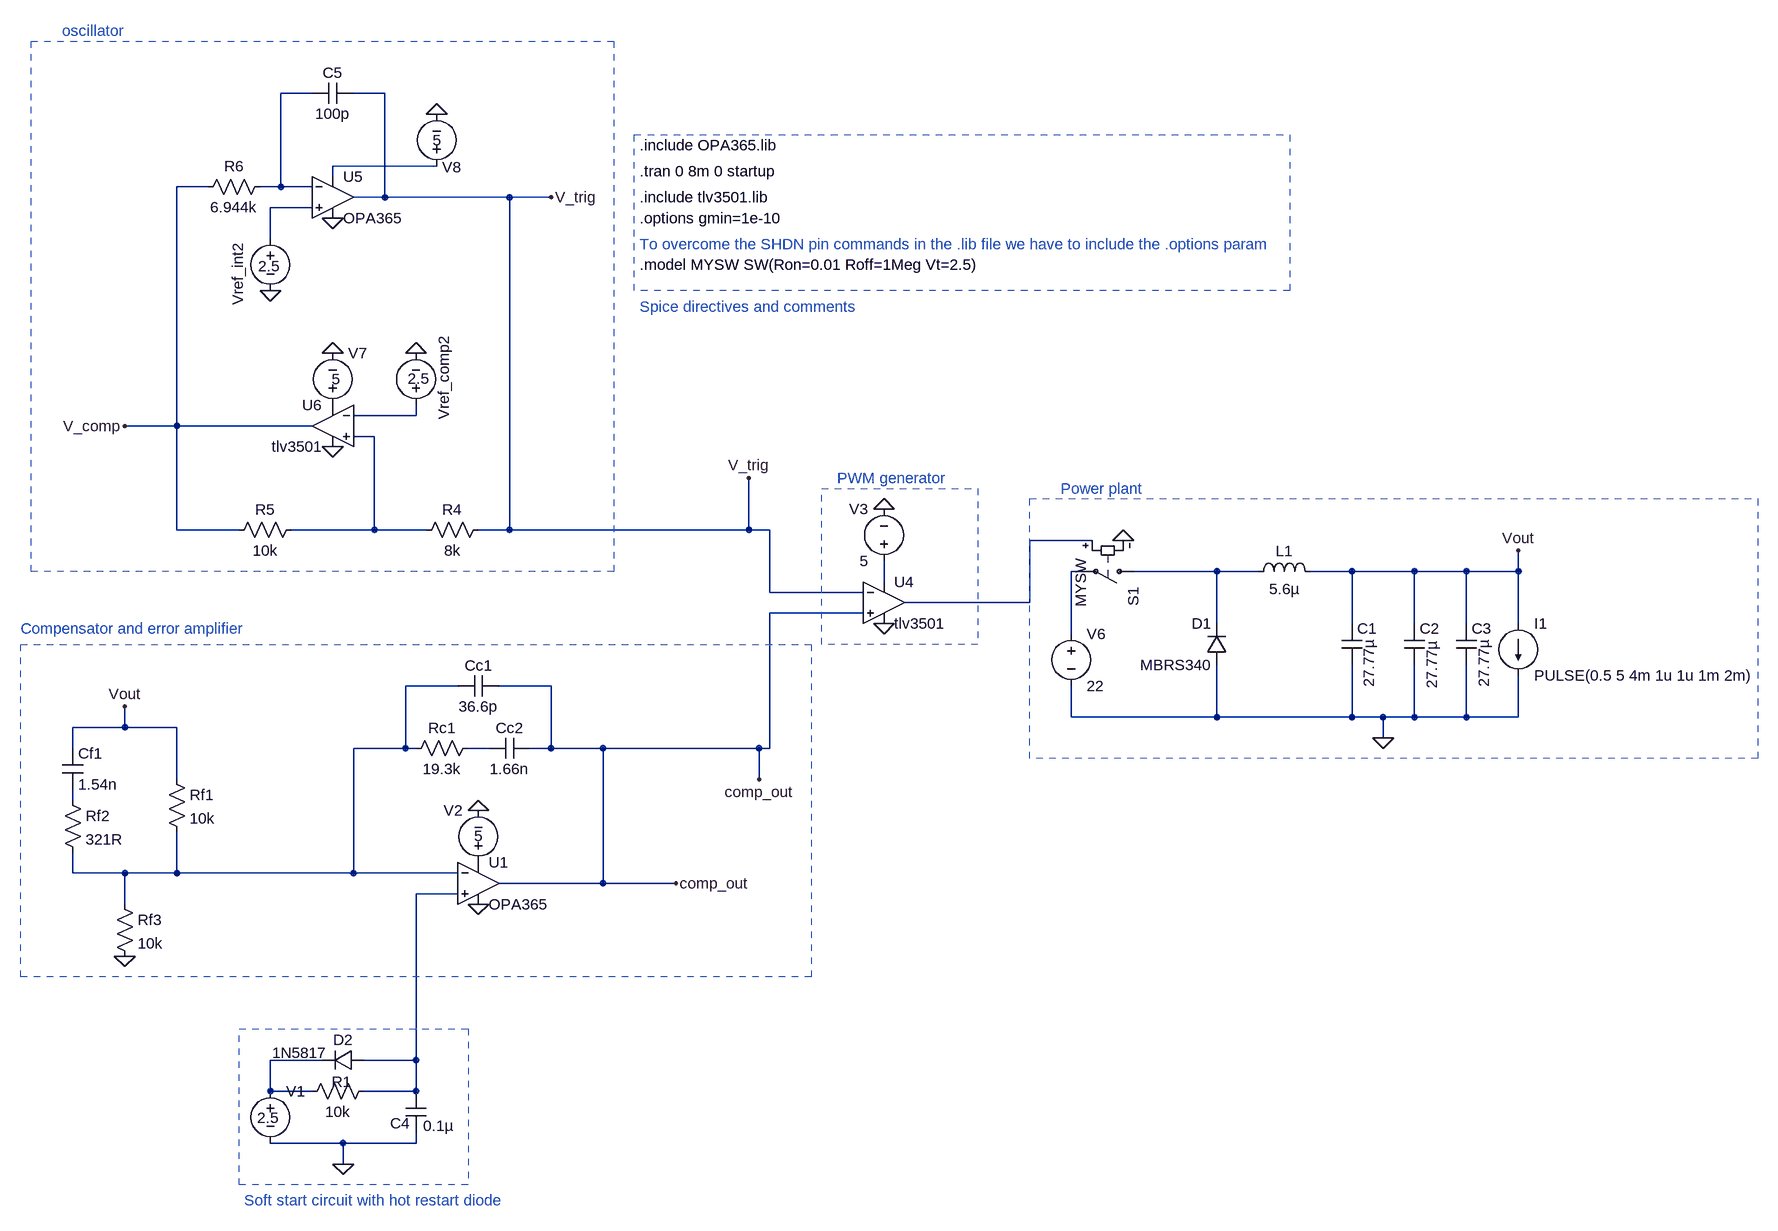
[diagram p0: schematic behavioural_model.asc]
behavioural_model.asc, the LTspice schematic file:
Version 4.1
SHEET 1 3716 1264
WIRE -48 -624 -96 -624
WIRE 64 -624 16 -624
WIRE 144 -512 -16 -512
WIRE -16 -496 -16 -512
WIRE -208 -480 -256 -480
WIRE -96 -480 -96 -624
WIRE -96 -480 -128 -480
WIRE -48 -480 -96 -480
WIRE 64 -464 64 -624
WIRE 64 -464 16 -464
WIRE 256 -464 64 -464
WIRE 320 -464 256 -464
WIRE -48 -448 -112 -448
WIRE -112 -400 -112 -448
WIRE 112 -128 112 -144
WIRE 112 -128 16 -128
WIRE -256 -112 -256 -480
WIRE -256 -112 -336 -112
WIRE -48 -112 -256 -112
WIRE 48 -96 16 -96
WIRE -256 48 -256 -112
WIRE -160 48 -256 48
WIRE 48 48 48 -96
WIRE 48 48 -80 48
WIRE 128 48 48 48
WIRE 256 48 256 -464
WIRE 256 48 208 48
WIRE 624 48 624 -32
WIRE 624 48 256 48
WIRE 656 48 624 48
WIRE 1152 64 1056 64
WIRE 1136 112 1120 112
WIRE 1344 112 1216 112
WIRE 1408 112 1344 112
WIRE 1552 112 1488 112
WIRE 1648 112 1552 112
WIRE 1728 112 1648 112
WIRE 1808 112 1808 80
WIRE 1808 112 1728 112
WIRE 832 128 832 96
WIRE 656 144 656 48
WIRE 800 144 656 144
WIRE 1056 160 1056 64
WIRE 1056 160 864 160
WIRE 800 176 656 176
WIRE 1344 192 1344 112
WIRE 1552 192 1552 112
WIRE 1648 192 1648 112
WIRE 1728 192 1728 112
WIRE 1808 192 1808 112
WIRE 1120 208 1120 112
WIRE 176 288 96 288
WIRE 320 288 240 288
WIRE 1120 336 1120 288
WIRE 1344 336 1344 256
WIRE 1344 336 1120 336
WIRE 1552 336 1552 256
WIRE 1552 336 1344 336
WIRE 1600 336 1552 336
WIRE 1648 336 1648 256
WIRE 1648 336 1600 336
WIRE 1728 336 1728 256
WIRE 1728 336 1648 336
WIRE 1808 336 1808 272
WIRE 1808 336 1728 336
WIRE -336 352 -336 320
WIRE -336 352 -416 352
WIRE -256 352 -336 352
WIRE 1600 368 1600 336
WIRE -416 384 -416 352
WIRE 96 384 96 288
WIRE 96 384 16 384
WIRE 112 384 96 384
WIRE 224 384 192 384
WIRE 320 384 320 288
WIRE 320 384 288 384
WIRE 400 384 320 384
WIRE 640 384 400 384
WIRE 656 384 656 176
WIRE 656 384 640 384
WIRE -256 432 -256 352
WIRE 640 432 640 384
WIRE -416 464 -416 448
WIRE -416 576 -416 544
WIRE -336 576 -416 576
WIRE -256 576 -256 512
WIRE -256 576 -336 576
WIRE 16 576 16 384
WIRE 16 576 -256 576
WIRE 176 576 16 576
WIRE 400 592 400 384
WIRE 400 592 240 592
WIRE 512 592 400 592
WIRE 176 608 112 608
WIRE -336 624 -336 576
WIRE -32 864 -112 864
WIRE 112 864 112 608
WIRE 112 864 32 864
WIRE -112 912 -112 864
WIRE -48 912 -112 912
WIRE 112 912 112 864
WIRE 112 912 32 912
WIRE 0 992 -112 992
WIRE 112 992 112 976
WIRE 112 992 0 992
WIRE 0 1024 0 992
FLAG 1600 368 0
FLAG -336 704 0
FLAG 208 480 0
FLAG 208 624 0
FLAG 512 592 comp_out
FLAG 1808 80 Vout
FLAG 832 192 0
FLAG 640 432 comp_out
FLAG 832 16 0
FLAG 1200 64 0
FLAG -16 -224 0
FLAG 144 -592 0
FLAG -16 -80 0
FLAG 112 -224 0
FLAG -112 -320 0
FLAG 320 -464 V_trig
FLAG -336 -112 V_comp
FLAG -16 -432 0
FLAG 624 -32 V_trig
FLAG -336 320 Vout
FLAG 0 1024 0
SYMBOL cap 1536 192 R0
WINDOW 3 42 24 VRight 2
SYMATTR Value 27.77µ
SYMATTR InstName C1
SYMATTR SpiceLine V=25 Rser=2.94m Lser=0.6n
SYMBOL ind 1392 128 R270
WINDOW 0 32 56 VTop 2
WINDOW 3 5 56 VBottom 2
SYMATTR InstName L1
SYMATTR Value 5.6µ
SYMATTR SpiceLine Rser=1m
SYMBOL voltage -112 896 R0
WINDOW 123 0 0 Left 0
WINDOW 39 0 0 Left 0
WINDOW 3 -20 57 Left 2
SYMATTR InstName V1
SYMATTR Value 2.5
SYMBOL res -272 416 R0
SYMATTR InstName Rf1
SYMATTR Value 10k
SYMBOL res -432 448 R0
SYMATTR InstName Rf2
SYMATTR Value 321R
SYMBOL cap -432 384 R0
SYMATTR InstName Cf1
SYMATTR Value 1.54n
SYMBOL res 208 368 R90
WINDOW 0 0 56 VBottom 2
WINDOW 3 32 56 VTop 2
SYMATTR InstName Rc1
SYMATTR Value 19.3k
SYMBOL cap 240 272 R90
WINDOW 0 0 32 VBottom 2
WINDOW 3 32 32 VTop 2
SYMATTR InstName Cc1
SYMATTR Value 36.6p
SYMBOL res -352 608 R0
SYMATTR InstName Rf3
SYMATTR Value 10k
SYMBOL voltage 208 576 R180
WINDOW 0 24 96 Left 2
WINDOW 3 -7 57 Left 2
WINDOW 123 0 0 Left 0
WINDOW 39 0 0 Left 0
SYMATTR InstName V2
SYMATTR Value 5
SYMBOL cap 288 368 R90
WINDOW 0 0 32 VBottom 2
WINDOW 3 32 32 VTop 2
SYMATTR InstName Cc2
SYMATTR Value 1.66n
SYMBOL cap 1632 192 R0
WINDOW 3 43 26 VRight 2
SYMATTR Value 27.77µ
SYMATTR InstName C2
SYMATTR SpiceLine V=25 Rser=2.94m Lser=0.6n
SYMBOL cap 1712 192 R0
WINDOW 3 43 24 VRight 2
SYMATTR Value 27.77µ
SYMATTR InstName C3
SYMATTR SpiceLine V=25 Rser=2.94m Lser=0.6n
SYMBOL OpAmps\\opamp2 832 96 R0
SYMATTR InstName U4
SYMATTR Value tlv3501
SYMBOL voltage 832 112 R180
WINDOW 0 24 96 Left 2
WINDOW 3 24 16 Left 2
WINDOW 123 0 0 Left 0
WINDOW 39 0 0 Left 0
SYMATTR InstName V3
SYMATTR Value 5
SYMBOL sw 1232 112 R90
WINDOW 3 -19 97 Left 2
SYMATTR Value MYSW
SYMATTR InstName S1
SYMBOL diode 1360 256 R180
WINDOW 0 24 64 Left 2
WINDOW 3 24 0 Left 2
SYMATTR InstName D1
SYMATTR Value MBRS340
SYMBOL voltage 1120 192 R0
WINDOW 123 0 0 Left 0
WINDOW 39 0 0 Left 0
SYMATTR InstName V6
SYMATTR Value 22
SYMBOL voltage -16 -128 M180
WINDOW 0 24 96 Left 2
WINDOW 3 -2 56 Left 2
WINDOW 123 0 0 Left 0
WINDOW 39 0 0 Left 0
SYMATTR InstName V7
SYMATTR Value 5
SYMBOL voltage 144 -496 R180
WINDOW 0 -38 14 Left 2
WINDOW 3 -7 56 Left 2
WINDOW 123 0 0 Left 0
WINDOW 39 0 0 Left 0
SYMATTR InstName V8
SYMATTR Value 5
SYMBOL res 224 32 R90
WINDOW 0 0 56 VBottom 2
WINDOW 3 32 56 VTop 2
SYMATTR InstName R4
SYMATTR Value 8k
SYMBOL res -64 32 R90
WINDOW 0 0 56 VBottom 2
WINDOW 3 32 56 VTop 2
SYMATTR InstName R5
SYMATTR Value 10k
SYMBOL res -112 -496 R90
WINDOW 0 0 56 VBottom 2
WINDOW 3 32 56 VTop 2
SYMATTR InstName R6
SYMATTR Value 6.944k
SYMBOL cap 16 -640 R90
WINDOW 0 0 32 VBottom 2
WINDOW 3 32 32 VTop 2
SYMATTR InstName C5
SYMATTR Value 100p
SYMBOL voltage 112 -128 R180
WINDOW 0 -43 -7 VRight 2
WINDOW 3 -21 57 Left 2
WINDOW 123 0 0 Left 0
WINDOW 39 0 0 Left 0
SYMATTR InstName Vref_comp2
SYMATTR Value 2.5
SYMBOL voltage -112 -416 R0
WINDOW 0 -50 22 VRight 2
WINDOW 3 -19 58 Left 2
WINDOW 123 0 0 Left 0
WINDOW 39 0 0 Left 0
SYMATTR InstName Vref_int2
SYMATTR Value 2.5
SYMBOL OpAmps\\opamp2 -16 -528 R0
SYMATTR InstName U5
SYMATTR Value OPA365
SYMBOL OpAmps\\opamp2 -16 -176 M0
SYMATTR InstName U6
SYMATTR Value tlv3501
SYMBOL OpAmps\\opamp2 208 528 R0
SYMATTR InstName U1
SYMATTR Value OPA365
SYMBOL res 48 896 R90
WINDOW 0 17 50 VBottom 2
WINDOW 3 32 56 VTop 2
SYMATTR InstName R1
SYMATTR Value 10k
SYMBOL cap 96 912 R0
WINDOW 0 -24 49 Left 2
WINDOW 3 27 53 Left 2
SYMATTR InstName C4
SYMATTR Value 0.1µ
SYMBOL diode 32 848 R90
WINDOW 0 0 32 VBottom 2
WINDOW 3 -11 99 VTop 2
SYMATTR InstName D2
SYMATTR Value 1N5817
SYMATTR Description Diode
SYMATTR Type diode
SYMBOL load2 1808 192 R0
WINDOW 123 0 0 Left 0
WINDOW 39 0 0 Left 0
SYMATTR InstName I1
SYMATTR Value PULSE(0.5 5 4m 1u 1u 1m 2m)
TEXT 456 -360 Left 2 !.model MYSW SW(Ron=0.01 Roff=1Meg Vt=2.5)
TEXT 456 -544 Left 2 !.include OPA365.lib
TEXT 456 -464 Left 2 !.include tlv3501.lib
TEXT 456 -504 Left 2 !.tran 0 8m 0 startup
TEXT 456 -432 Left 2 !.options gmin=1e-10
TEXT 456 -392 Left 2 ;To overcome the SHDN pin commands in the .lib file we have to include the .options param
TEXT 456 -296 Left 2 ;Spice directives and comments
TEXT -432 -720 Left 2 ;oscillator
TEXT -496 200 Left 2 ;Compensator and error amplifier
TEXT 760 -32 Left 2 ;PWM generator
TEXT 1104 -16 Left 2 ;Power plant
TEXT -152 1080 Left 2 ;Soft start circuit with hot restart diode
RECTANGLE Normal 1456 -320 448 -560 2
RECTANGLE Normal -480 -704 416 112 2
RECTANGLE Normal 720 736 -496 224 2
RECTANGLE Normal 976 224 736 -16 2
RECTANGLE Normal 2176 400 1056 0 2
RECTANGLE Normal 192 1056 -160 816 2

The netlist it stands for:
* behavioural_model.asc
C1 Vout 0 27.77µ V=25 Rser=2.94m Lser=0.6n
L1 N008 Vout 5.6µ Rser=1m
V1 N014 0 2.5
Rf1 Vout N010 10k
Rf2 N012 N010 321R
Cf1 Vout N012 1.54n
Rc1 N011 N010 19.3k
Cc1 comp_out N010 36.6p
Rf3 N010 0 10k
V2 P001 0 5
Cc2 comp_out N011 1.66n
C2 Vout 0 27.77µ V=25 Rser=2.94m Lser=0.6n
C3 Vout 0 27.77µ V=25 Rser=2.94m Lser=0.6n
X§U4 comp_out V_trig N009 0 N006 tlv3501  ; pins In+ In- V+ V- OUT
V3 N009 0 5
S1 N008 N007 N006 0 MYSW
D1 0 N008 MBRS340
V6 N007 0 22
V7 P002 0 5
V8 N002 0 5
R4 V_trig N005 8k
R5 N005 V_comp 10k
R6 N001 V_comp 6.944k
C5 V_trig N001 100p
Vref_comp2 N004 0 2.5
Vref_int2 N003 0 2.5
X§U5 N003 N001 N002 0 V_trig OPA365  ; pins In+ In- V+ V- OUT
X§U6 N005 N004 P002 0 V_comp tlv3501  ; pins In+ In- V+ V- OUT
X§U1 N013 N010 P001 0 comp_out OPA365  ; pins In+ In- V+ V- OUT
R1 N013 N014 10k
C4 N013 0 0.1µ
D2 N013 N014 1N5817
I1 Vout 0 PULSE(0.5 5 4m 1u 1u 1m 2m)
.model D D
.lib standard.dio
.model MYSW SW(Ron=0.01 Roff=1Meg Vt=2.5)
.include OPA365.lib
.include tlv3501.lib
.tran 0 8m 0 startup
.options gmin=1e-10
* To overcome the SHDN pin commands in the .lib file we have to include the .options param
* Spice directives and comments
* oscillator
* Compensator and error amplifier
* PWM generator
* Power plant
* Soft start circuit with hot restart diode
.backanno
.end